# EAGLE design atmega328p_dip28 (EAGLE 8.5.0)
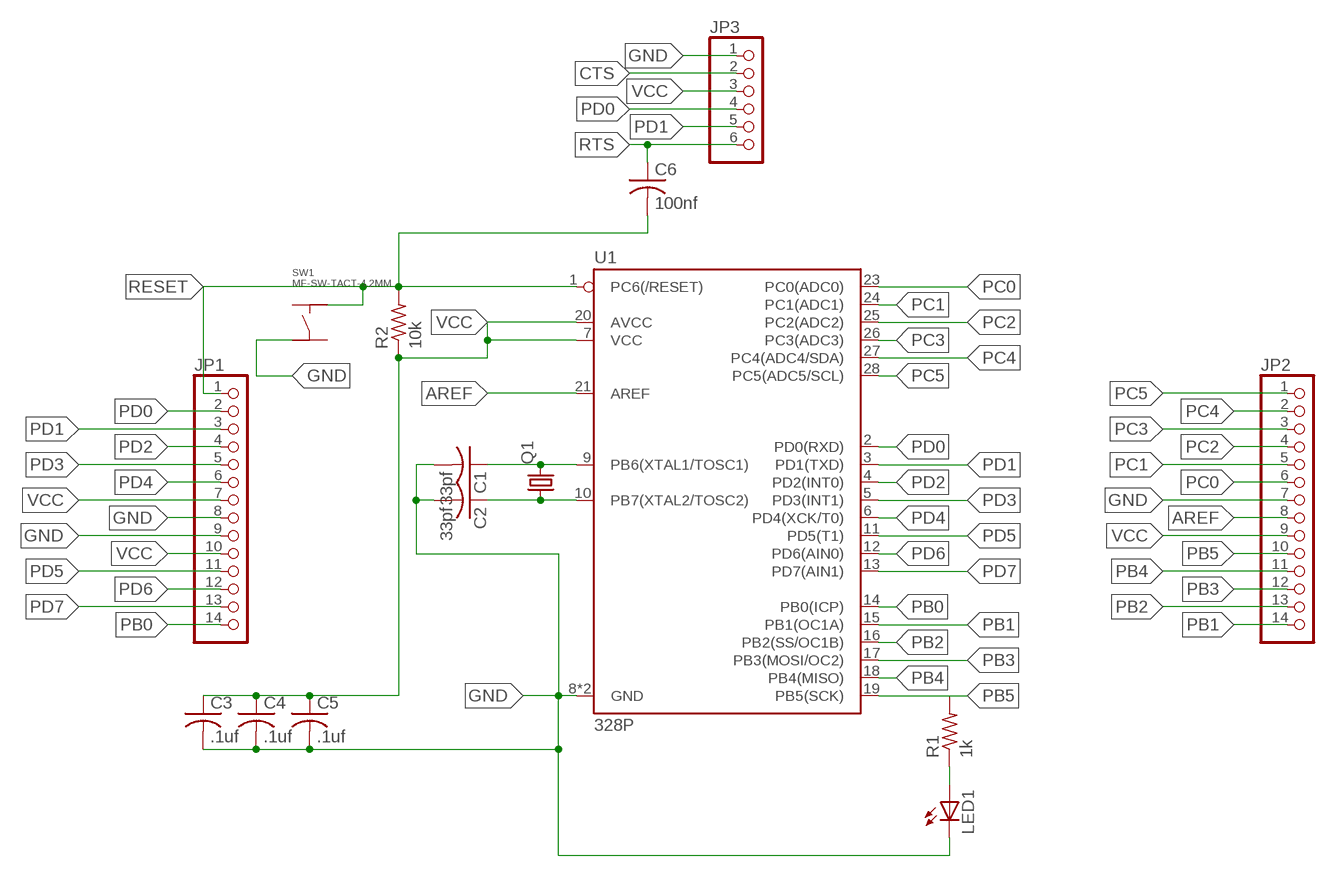
[diagram p0: schematic, sheet 1]

## Parts
C1  33pf  C-USC0603K  [C0603K]
C2  33pf  C-USC0603K  [C0603K]
C3  .1uf  C-USC0603  [C0603]
C4  .1uf  C-USC0603  [C0603]
C5  .1uf  C-USC0603  [C0603]
C6  100nf  C-USC0603  [C0603]
JP1  PINHD-1X14-CB  [1X14-CB]
JP2  PINHD-1X14-CB  [1X14-CB]
JP3  PINHD-1X6  [1X06]
LED1  LEDCHIP-LED0805  [CHIP-LED0805]
Q1  CRYSTALCTS406  [CTS406]
R1  1k  R-US_R0603  [R0603]
R2  10k  R-US_R0603  [R0603]
SW1  MF-SW-TACT-4.2MM  MF_SWITCHES_TACT_4.2MM  [MF_SWITCHES_TACT4.2MM]
U1  328P  ATMEGA328P_PDIP  [DIP28]

## Nets
AREF: JP2.8 U1.21(AREF)
CTS: JP3.2
GND: C1.2 C2.2 C3.2 C4.2 C5.2 JP1.8 JP1.9 JP2.7 JP3.1 LED1.C SW1.P$3 U1.8(GND) U1.22(GND)
N$1: C1.1 Q1.3 U1.9(PB6(XTAL1/TOSC1))
N$2: C2.1 Q1.1 U1.10(PB7(XTAL2/TOSC2))
N$3: LED1.A R1.1
PB0: JP1.14 U1.14(PB0(ICP))
PB1: JP2.14 U1.15(PB1(OC1A))
PB2: JP2.13 U1.16(PB2(SS/OC1B))
PB3: JP2.12 U1.17(PB3(MOSI/OC2))
PB4: JP2.11 U1.18(PB4(MISO))
PB5: JP2.10 R1.2 U1.19(PB5(SCK))
PC0: JP2.6 U1.23(PC0(ADC0))
PC1: JP2.5 U1.24(PC1(ADC1))
PC2: JP2.4 U1.25(PC2(ADC2))
PC3: JP2.3 U1.26(PC3(ADC3))
PC4: JP2.2 U1.27(PC4(ADC4/SDA))
PC5: JP2.1 U1.28(PC5(ADC5/SCL))
PD0: JP1.2 JP3.4 U1.2(PD0(RXD))
PD1: JP1.3 JP3.5 U1.3(PD1(TXD))
PD2: JP1.4 U1.4(PD2(INT0))
PD3: JP1.5 U1.5(PD3(INT1))
PD4: JP1.6 U1.6(PD4(XCK/T0))
PD5: JP1.11 U1.11(PD5(T1))
PD6: JP1.12 U1.12(PD6(AIN0))
PD7: JP1.13 U1.13(PD7(AIN1))
RESET: C6.2 JP1.1 R2.2 SW1.P$2 U1.1(PC6(/RESET))
RTS: C6.1 JP3.6
VCC: C3.1 C4.1 C5.1 JP1.7 JP1.10 JP2.9 JP3.3 R2.1 U1.7(VCC) U1.20(AVCC)
Unconnected: SW1.P$1 SW1.P$4

## Library data of the parts
C1 C2 = resistor:C-US: CAPACITOR, American symbol
C3-C6 = rcl:C-US: CAPACITOR, American symbol; SPICEPREFIX: C
JP1 JP2 = adafruit:PINHD-1X14: PIN HEADER
JP3 = adafruit:PINHD-1X6: PIN HEADER
LED1 = adafruit:LED: LED OSRAM: - CHIPLED LG R971, LG N971, LY N971, LG Q971, LY Q971, LO R971, LY R971 LH N974, LH R974 LS Q976, LO Q976, LY Q976 LO Q996 - Hyper CHIPLED LW Q18S LB Q993, LB Q99A, LB R99A - SideLED LS A670, LO A670, LY A670, LG A670, LP A670 LB A673, LV A673, LT A673, LW A673 LH A674 LY A675 LS A676, LA A676, LO A676, LY A676, LW A676 LS A679, LY A679, LG A679 - Hyper Micro SIDELED® LS Y876, LA Y876, LO Y876, LY Y876 LT Y87S - SmartLED LW L88C, LW L88S LB L89C, LB L89S, LG L890 LS L89K, LO L89K, LY L89K LS L896, LA L896, LO L896, LY L896 - TOPLED LS T670, LO T670, LY T670, LG T670, LP T670 LSG T670, LSP T670, LSY T670, LOP T670, LYG T670 LG T671, LOG T671, LSG T671 LB T673, LV T673, LT T673, LW T673 LH T674 LS T676, LA T676, LO T676, LY T676, LB T676, LH T676, LSB T676, LW T676 LB T67C, LV T67C, LT T67C, LS T67K, LO T67K, LY T67K, LW E67C LS E67B, LA E67B, LO E67B, LY E67B, LB E67C, LV E67C, LT E67C LW T67C LS T679, LY T679, LG T679 LS T770, LO T770, LY T770, LG T770, LP T770 LB T773, LV T773, LT T773, LW T773 LH T774 LS E675, LA E675, LY E675, LS T675 LS T776, LA T776, LO T776, LY T776, LB T776 LHGB T686 LT T68C, LB T68C - Hyper Mini TOPLED® LB M676 - Mini TOPLED Santana® LG M470 LS M47K, LO M47K, LY M47K Source: http://www.osram.convergy.de/
Q1 = adafruit:CRYSTAL: CRYSTAL; OC_FARNELL: unknown; OC_NEWARK: unknown
R1 R2 = rcl:R-US_: RESISTOR, American symbol; SPICEPREFIX: R
SW1 = PinoTaur:MF_SWITCHES_TACT: Library: MF_Switches Description: Device for Tact Switches. Manufacture part number (MFG#) can be added via Attributes.; HOUSEPART: YES; MPN: MF-SW-TACT-4.2MM; POPULATE: 1; URL: https://factory.macrofab.com/part/MF-SW-TACT-4.2MM
U1 = SparkFun-IC-Microcontroller:ATMEGA328P_PDIP: Atmel 328P Through hole ATMEGA328P uC used in the Arduino 32kb flash, 1k EEPROM, 2k SRAM Datasheet <http://www.sparkfun.com/datasheets/Components/SMD/ATMega328.pdf> SparkFun Products Storefront component: AVR 28 Pin 20MHz 32K 6A/D - ATMega328P <https://www.sparkfun.com/products/9061> (COM-09061) SparkFun Simon Says - Through-Hole Soldering Kit <https://www.sparkfun.com/products/10547> (KIT-10547) SparkFun Learn to Solder - Simon Says <https://www.sparkfun.com/products/13708> (KIT-13708) SparkFun BigTime Watch Kit <https://www.sparkfun.com/products/11734> (KIT-11734) SparkFun ClockIt <https://www.sparkfun.com/products/10930> (KIT-10930) SparkFun Serial Enabled LCD Kit <https://www.sparkfun.com/products/10097> (LCD-10097) SparkFun Simon Tilts - Through Hole Soldering Kit <https://www.sparkfun.com/products/12634> (KIT-12634) SparkFun Frequency Counter Kit <https://www.sparkfun.com/products/10140> (KIT-10140) FabFM Radio Kit <https://www.sparkfun.com/products/11043> (KIT-11043) SparkFun Binary Blaster Kit <https://www.sparkfun.com/products/12037> (KIT-12037) SparkFun Metro-Gnome <https://www.sparkfun.com/products/9236> (KIT-09236) ATmega328 with Arduino Optiboot (Uno) <https://www.sparkfun.com/products/10524> (DEV-10524); PROD_ID: IC-09136

## Board
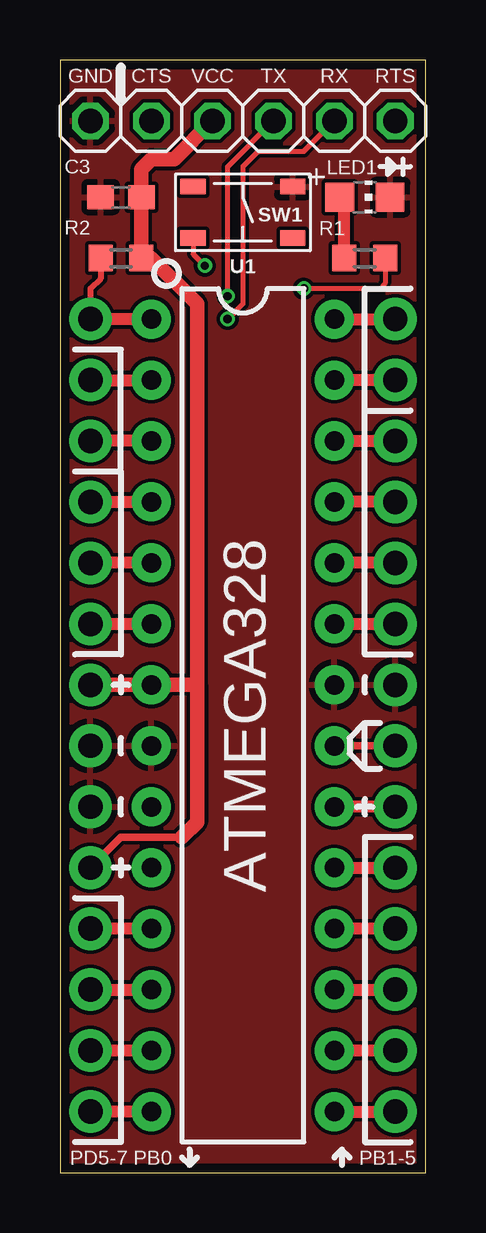
[diagram p1: board, top side]
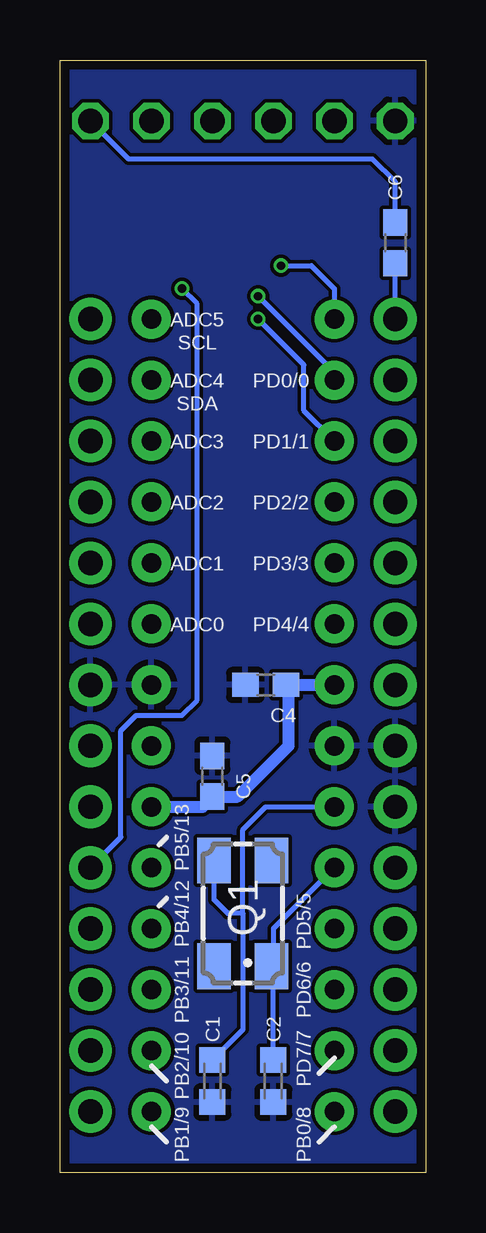
[diagram p2: board, bottom side, seen from below]

Size 15.24 x 46.35 mm. Coordinates in mm from the lower left corner, seen from the top.
Outline: 0,0 15.24,0 15.24,46.35 0,46.35 0,0
Copper layers (1*16): Top 0.035559375mm / dielectric 1.6mm / Bottom 0.035559375mm
Design rules "oshpark-2layer": minimum track width 6mil, minimum drill 10mil, track to track 6mil, track to pad 6mil, pad to pad 6mil, via to via 6mil, smd to smd 6mil, copper to edge 15mil, drill to drill 6mil, minimum pad ring 5mil, minimum via ring 5mil, stop-mask expansion 2.5mil, vias tented up to drill 0mil, thermal gap 10mil

### Footprints (pad centres in the part's own frame; a part is rotated, then mirrored left to right if it is on the bottom)
C0603K = smd 1.05 x 1.08: 1 -0.875,0; 2 0.875,0
C0603 = smd 1.1 x 1: 1 -0.85,0; 2 0.85,0
1X14-CB = drill 1.016 pad 1.778: 1 -16.51,0; 2 -13.97,0; 3 -11.43,0; 4 -8.89,0; 5 -6.35,0; 6 -3.81,0; 7 -1.27,0; 8 1.27,0; 9 3.81,0; 10 6.35,0; 11 8.89,0; 12 11.43,0; 13 13.97,0; 14 16.51,0
1X06 = drill 1.016 octagon: 1 -6.35,0; 2 -3.81,0; 3 -1.27,0; 4 1.27,0; 5 3.81,0; 6 6.35,0
CHIP-LED0805 = smd 1.2 x 1.2: A 0,-1.05; C 0,1.05
CTS406 = smd 1.9 x 1.4: 1 -2.2,-1.2; 2 2.2,-1.2; 3 2.2,1.2; 4 -2.2,1.2
R0603 = smd 1 x 1.1: 1 -0.85,0; 2 0.85,0
MF_SWITCHES_TACT4.2MM = smd 1.05 x 0.65: P$1 -2.075,1.075; P$2 2.075,1.075; P$3 -2.075,-1.075; P$4 2.075,-1.075
DIP28 = drill 0.813 pad 1.626: 1 -16.51,-3.81; 2 -13.97,-3.81; 3 -11.43,-3.81; 4 -8.89,-3.81; 5 -6.35,-3.81; 6 -3.81,-3.81; 7 -1.27,-3.81; 8 1.27,-3.81; 9 3.81,-3.81; 10 6.35,-3.81; 11 8.89,-3.81; 12 11.43,-3.81; 13 13.97,-3.81; 14 16.51,-3.81; 15 16.51,3.81; 16 13.97,3.81; 17 11.43,3.81; 18 8.89,3.81; 19 6.35,3.81; 20 3.81,3.81; 21 1.27,3.81; 22 -1.27,3.81; 23 -3.81,3.81; 24 -6.35,3.81; 25 -8.89,3.81; 26 -11.43,3.81; 27 -13.97,3.81; 28 -16.51,3.81

### Placement (x,y rotation side)
C1  8.89,3.81 270 bottom
C2  6.35,3.81 270 bottom
C3  2.54,40.64 180 top
C4  6.67,20.32 180 bottom
C5  8.89,16.51 90 bottom
C6  1.27,38.73 270 bottom
JP1  1.27,19.05 270 top
JP2  13.97,19.05 270 top
JP3  7.62,43.81 0 top
LED1  12.7,40.64 270 top
Q1  7.62,10.79 90 bottom
R1  12.7,38.1 0 top
R2  2.54,38.1 180 top
SW1  7.62,40.01 180 top
U1  7.62,19.05 270 top

### Tracks (layer width: path | path; a pad name or v marks a point on that pad's centre or on a via)
AREF
  Top 0.305: U1.21 JP2.8
GND
  pour Top: -2.54,-1.91 19.05,-1.91 19.05,48.26 -1.91,48.26 -2.54,47.62
  pour Bottom: -3.81,49.53 20.32,49.53 20.32,-3.17 -3.81,-3.17
N$1
  Bottom 0.152: 8.82,12.7 Q1.3
  Bottom 0.203: 7.62,10.79 7.62,14.29 6.67,15.24 U1.9 | 7.62,10.79 8.26,10.79 8.82,11.36 8.82,12.7 | C1.1 7.62,5.96 7.62,10.79
N$2
  Bottom 0.152: 6.35,8.26 6.35,8.53 Q1.1 6.12,8.89
  Bottom 0.203: C2.1 6.35,8.26 | U1.10 6.35,10.16 6.35,8.66 Q1.1
N$3
  Top 0.508: R1.1 11.85,40.44 LED1.A
PB0
  Top 0.508: U1.14 JP1.14
PB1
  Top 0.508: U1.15 JP2.14
PB2
  Top 0.508: JP2.13 U1.16
PB3
  Top 0.508: U1.17 JP2.12
PB4
  Top 0.508: JP2.11 U1.18
PB5  (via drill 0.35)
  Top 0.203: R1.2 13.55,37.05 13.34,36.83 v10.16,36.83
  Top 0.508: U1.19 JP2.10
  Bottom 0.203: JP2.10 12.7,13.97 12.7,18.41 12.06,19.05 10.16,19.05 9.53,19.68 9.53,36.2 v10.16,36.83
PC0
  Top 0.508: U1.23 JP2.6
PC1
  Top 0.508: JP2.5 U1.24
PC2
  Top 0.508: JP2.4 U1.25
PC3
  Top 0.508: U1.26 JP2.3
PC4
  Top 0.508: JP2.2 U1.27
PC5
  Top 0.508: U1.28 JP2.1
PD0  (via drill 0.35)
  Top 0.203: v6.99,36.51 6.99,41.91 JP3.4
  Top 0.508: JP1.2 U1.2
  Bottom 0.203: v6.99,36.51 3.81,33.34 U1.2
PD1  (via drill 0.35)
  Top 0.203: JP3.5 10.16,42.55 8.26,42.55 7.62,41.91 7.62,36.2 v6.99,35.56
  Top 0.508: U1.3 JP1.3
  Bottom 0.203: U1.3 5.08,31.75 5.08,33.66 v6.99,35.56
PD2
  Top 0.508: JP1.4 U1.4
PD3
  Top 0.508: U1.5 JP1.5
PD4
  Top 0.508: JP1.6 U1.6
PD5
  Top 0.508: U1.11 JP1.11
PD6
  Top 0.508: JP1.12 U1.12
PD7
  Top 0.508: U1.13 JP1.13
RESET  (via drill 0.35)
  Top 0.203: SW1.P$2 5.54,38.27 v6.03,37.78
  Top 0.254: R2.2 1.69,37.25 1.27,36.83 JP1.1
  Top 0.508: U1.1 JP1.1
  Bottom 0.203: U1.1 3.81,36.83 4.76,37.78 v6.03,37.78 | JP1.1 C6.2
RTS
  Bottom 0.203: C6.1 1.27,41.27 2.22,42.23 12.38,42.23 JP3.6
VCC
  Top 0.305: JP1.10 2.54,13.97 5.08,13.97
  Top 0.508: JP2.9 U1.20
  Top 0.61: JP3.3 4.76,42.23 3.81,42.23 3.39,41.81 C3.1 R2.1 3.81,38.1 5.71,36.2 5.71,20.32 | 5.08,13.97 5.71,14.61 5.71,20.32 | 5.71,20.32 U1.7 JP1.7
  Bottom 0.508: U1.7 C4.1 5.71,20.22 5.71,17.78 7.83,15.66 C5.1 9.31,15.24 U1.20

### Text on the board
tPlace: GND | CTS | VCC | TX | RX | RTS | ATMEGA328 | PD5-7 PB0 | PB1-5
bPlace: ADC5 | SCL | PD0/0 | ADC4 | SDA | PD1/1 | ADC3 | PD2/2 | ADC2 | PD3/3 | ADC1 | PD4/4 | ADC0 | PB5/13 | PB4/12 | PD5/5 | PD6/6 | PB3/11 | PD7/7 | PB2/10 | PB0/8 | PB1/9